# Altium schematic sheet CONN.SchDoc
size B
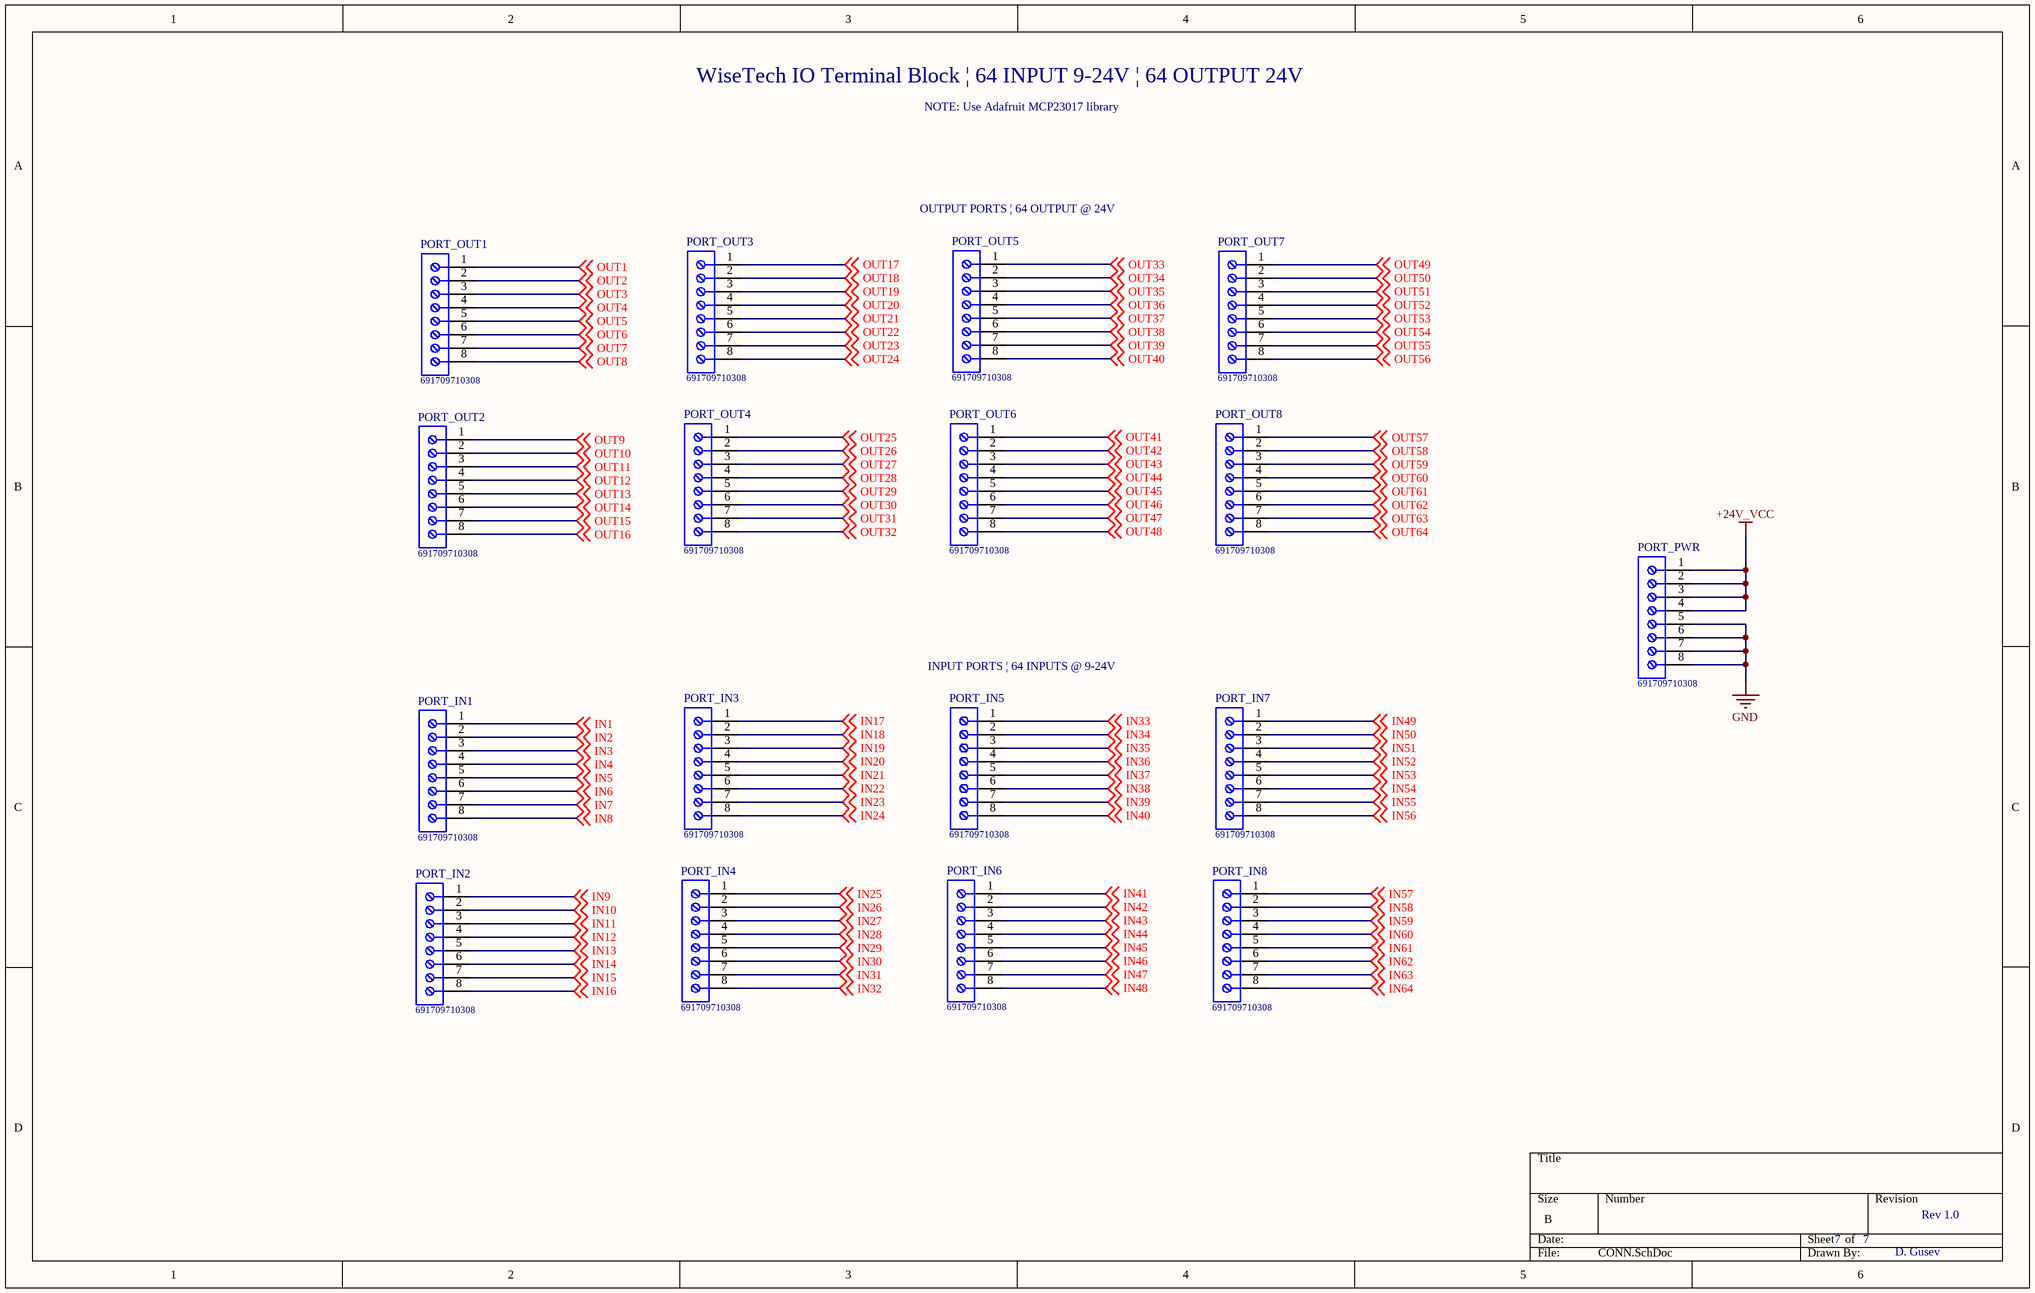
[diagram p0: CONN.SchDoc]

## Parts
PORT_IN1  691709710308  [691709710308]
PORT_IN2  691709710308  [691709710308]
PORT_IN3  691709710308  [691709710308]
PORT_IN4  691709710308  [691709710308]
PORT_IN5  691709710308  [691709710308]
PORT_IN6  691709710308  [691709710308]
PORT_IN7  691709710308  [691709710308]
PORT_IN8  691709710308  [691709710308]
PORT_OUT1  691709710308  [691709710308]
PORT_OUT2  691709710308  [691709710308]
PORT_OUT3  691709710308  [691709710308]
PORT_OUT4  691709710308  [691709710308]
PORT_OUT5  691709710308  [691709710308]
PORT_OUT6  691709710308  [691709710308]
PORT_OUT7  691709710308  [691709710308]
PORT_OUT8  691709710308  [691709710308]
PORT_PWR  691709710308  [691709710308]

## Nets
+24V_VCC: PORT_PWR.1 PORT_PWR.2 PORT_PWR.3 PORT_PWR.4
GND: PORT_PWR.5 PORT_PWR.6 PORT_PWR.7 PORT_PWR.8
IN1: PORT_IN1.1 ; off-sheet IN1
IN2: PORT_IN1.2 ; off-sheet IN2
IN3: PORT_IN1.3 ; off-sheet IN3
IN4: PORT_IN1.4 ; off-sheet IN4
IN5: PORT_IN1.5 ; off-sheet IN5
IN6: PORT_IN1.6 ; off-sheet IN6
IN7: PORT_IN1.7 ; off-sheet IN7
IN8: PORT_IN1.8 ; off-sheet IN8
IN9: PORT_IN2.1 ; off-sheet IN9
IN10: PORT_IN2.2 ; off-sheet IN10
IN11: PORT_IN2.3 ; off-sheet IN11
IN12: PORT_IN2.4 ; off-sheet IN12
IN13: PORT_IN2.5 ; off-sheet IN13
IN14: PORT_IN2.6 ; off-sheet IN14
IN15: PORT_IN2.7 ; off-sheet IN15
IN16: PORT_IN2.8 ; off-sheet IN16
IN17: PORT_IN3.1 ; off-sheet IN17
IN18: PORT_IN3.2 ; off-sheet IN18
IN19: PORT_IN3.3 ; off-sheet IN19
IN20: PORT_IN3.4 ; off-sheet IN20
IN21: PORT_IN3.5 ; off-sheet IN21
IN22: PORT_IN3.6 ; off-sheet IN22
IN23: PORT_IN3.7 ; off-sheet IN23
IN24: PORT_IN3.8 ; off-sheet IN24
IN25: PORT_IN4.1 ; off-sheet IN25
IN26: PORT_IN4.2 ; off-sheet IN26
IN27: PORT_IN4.3 ; off-sheet IN27
IN28: PORT_IN4.4 ; off-sheet IN28
IN29: PORT_IN4.5 ; off-sheet IN29
IN30: PORT_IN4.6 ; off-sheet IN30
IN31: PORT_IN4.7 ; off-sheet IN31
IN32: PORT_IN4.8 ; off-sheet IN32
IN33: PORT_IN5.1 ; off-sheet IN33
IN34: PORT_IN5.2 ; off-sheet IN34
IN35: PORT_IN5.3 ; off-sheet IN35
IN36: PORT_IN5.4 ; off-sheet IN36
IN37: PORT_IN5.5 ; off-sheet IN37
IN38: PORT_IN5.6 ; off-sheet IN38
IN39: PORT_IN5.7 ; off-sheet IN39
IN40: PORT_IN5.8 ; off-sheet IN40
IN41: PORT_IN6.1 ; off-sheet IN41
IN42: PORT_IN6.2 ; off-sheet IN42
IN43: PORT_IN6.3 ; off-sheet IN43
IN44: PORT_IN6.4 ; off-sheet IN44
IN45: PORT_IN6.5 ; off-sheet IN45
IN46: PORT_IN6.6 ; off-sheet IN46
IN47: PORT_IN6.7 ; off-sheet IN47
IN48: PORT_IN6.8 ; off-sheet IN48
IN49: PORT_IN7.1 ; off-sheet IN49
IN50: PORT_IN7.2 ; off-sheet IN50
IN51: PORT_IN7.3 ; off-sheet IN51
IN52: PORT_IN7.4 ; off-sheet IN52
IN53: PORT_IN7.5 ; off-sheet IN53
IN54: PORT_IN7.6 ; off-sheet IN54
IN55: PORT_IN7.7 ; off-sheet IN55
IN56: PORT_IN7.8 ; off-sheet IN56
IN57: PORT_IN8.1 ; off-sheet IN57
IN58: PORT_IN8.2 ; off-sheet IN58
IN59: PORT_IN8.3 ; off-sheet IN59
IN60: PORT_IN8.4 ; off-sheet IN60
IN61: PORT_IN8.5 ; off-sheet IN61
IN62: PORT_IN8.6 ; off-sheet IN62
IN63: PORT_IN8.7 ; off-sheet IN63
IN64: PORT_IN8.8 ; off-sheet IN64
OUT1: PORT_OUT1.1 ; off-sheet OUT1
OUT2: PORT_OUT1.2 ; off-sheet OUT2
OUT3: PORT_OUT1.3 ; off-sheet OUT3
OUT4: PORT_OUT1.4 ; off-sheet OUT4
OUT5: PORT_OUT1.5 ; off-sheet OUT5
OUT6: PORT_OUT1.6 ; off-sheet OUT6
OUT7: PORT_OUT1.7 ; off-sheet OUT7
OUT8: PORT_OUT1.8 ; off-sheet OUT8
OUT9: PORT_OUT2.1 ; off-sheet OUT9
OUT10: PORT_OUT2.2 ; off-sheet OUT10
OUT11: PORT_OUT2.3 ; off-sheet OUT11
OUT12: PORT_OUT2.4 ; off-sheet OUT12
OUT13: PORT_OUT2.5 ; off-sheet OUT13
OUT14: PORT_OUT2.6 ; off-sheet OUT14
OUT15: PORT_OUT2.7 ; off-sheet OUT15
OUT16: PORT_OUT2.8 ; off-sheet OUT16
OUT17: PORT_OUT3.1 ; off-sheet OUT17
OUT18: PORT_OUT3.2 ; off-sheet OUT18
OUT19: PORT_OUT3.3 ; off-sheet OUT19
OUT20: PORT_OUT3.4 ; off-sheet OUT20
OUT21: PORT_OUT3.5 ; off-sheet OUT21
OUT22: PORT_OUT3.6 ; off-sheet OUT22
OUT23: PORT_OUT3.7 ; off-sheet OUT23
OUT24: PORT_OUT3.8 ; off-sheet OUT24
OUT25: PORT_OUT4.1 ; off-sheet OUT25
OUT26: PORT_OUT4.2 ; off-sheet OUT26
OUT27: PORT_OUT4.3 ; off-sheet OUT27
OUT28: PORT_OUT4.4 ; off-sheet OUT28
OUT29: PORT_OUT4.5 ; off-sheet OUT29
OUT30: PORT_OUT4.6 ; off-sheet OUT30
OUT31: PORT_OUT4.7 ; off-sheet OUT31
OUT32: PORT_OUT4.8 ; off-sheet OUT32
OUT33: PORT_OUT5.1 ; off-sheet OUT33
OUT34: PORT_OUT5.2 ; off-sheet OUT34
OUT35: PORT_OUT5.3 ; off-sheet OUT35
OUT36: PORT_OUT5.4 ; off-sheet OUT36
OUT37: PORT_OUT5.5 ; off-sheet OUT37
OUT38: PORT_OUT5.6 ; off-sheet OUT38
OUT39: PORT_OUT5.7 ; off-sheet OUT39
OUT40: PORT_OUT5.8 ; off-sheet OUT40
OUT41: PORT_OUT6.1 ; off-sheet OUT41
OUT42: PORT_OUT6.2 ; off-sheet OUT42
OUT43: PORT_OUT6.3 ; off-sheet OUT43
OUT44: PORT_OUT6.4 ; off-sheet OUT44
OUT45: PORT_OUT6.5 ; off-sheet OUT45
OUT46: PORT_OUT6.6 ; off-sheet OUT46
OUT47: PORT_OUT6.7 ; off-sheet OUT47
OUT48: PORT_OUT6.8 ; off-sheet OUT48
OUT49: PORT_OUT7.1 ; off-sheet OUT49
OUT50: PORT_OUT7.2 ; off-sheet OUT50
OUT51: PORT_OUT7.3 ; off-sheet OUT51
OUT52: PORT_OUT7.4 ; off-sheet OUT52
OUT53: PORT_OUT7.5 ; off-sheet OUT53
OUT54: PORT_OUT7.6 ; off-sheet OUT54
OUT55: PORT_OUT7.7 ; off-sheet OUT55
OUT56: PORT_OUT7.8 ; off-sheet OUT56
OUT57: PORT_OUT8.1 ; off-sheet OUT57
OUT58: PORT_OUT8.2 ; off-sheet OUT58
OUT59: PORT_OUT8.3 ; off-sheet OUT59
OUT60: PORT_OUT8.4 ; off-sheet OUT60
OUT61: PORT_OUT8.5 ; off-sheet OUT61
OUT62: PORT_OUT8.6 ; off-sheet OUT62
OUT63: PORT_OUT8.7 ; off-sheet OUT63
OUT64: PORT_OUT8.8 ; off-sheet OUT64

## Notes on the sheet
- WiseTech IO Terminal Block | 64 INPUT 9-24V | 64 OUTPUT 24V
- NOTE: Use Adafruit MCP23017 library
- (near PORT_OUT5) OUTPUT PORTS | 64 OUTPUT @ 24V
- (near PORT_IN5) INPUT PORTS | 64 INPUTS @ 9-24V
- 7
- Rev 1.0
- D. Gusev

## Library data of the parts
PORT_IN1-PORT_IN8 PORT_OUT1-PORT_OUT8 PORT_PWR = CMP-1502-03340-1: Serie 7097 - 5.00 mm Horizontal Entry SMT with Pressure Clamp WR-TBL, 8 pin; Manufacturer: Wurth Elektronik; Pin Number: 8; Pitch: 5.00mm; Datasheet URL: http://katalog.we-online.de/em/datasheet/6917097103xx.pdf; Publisher: WurthElektronik; Part Number: 691709710308; Operating Temperature: -45to130degC; Mounting Technology: SMT; Package Reference: 691709710308; Packaging: TapeandReelwithCap; Manufacturer URL: http://www.we-online.de